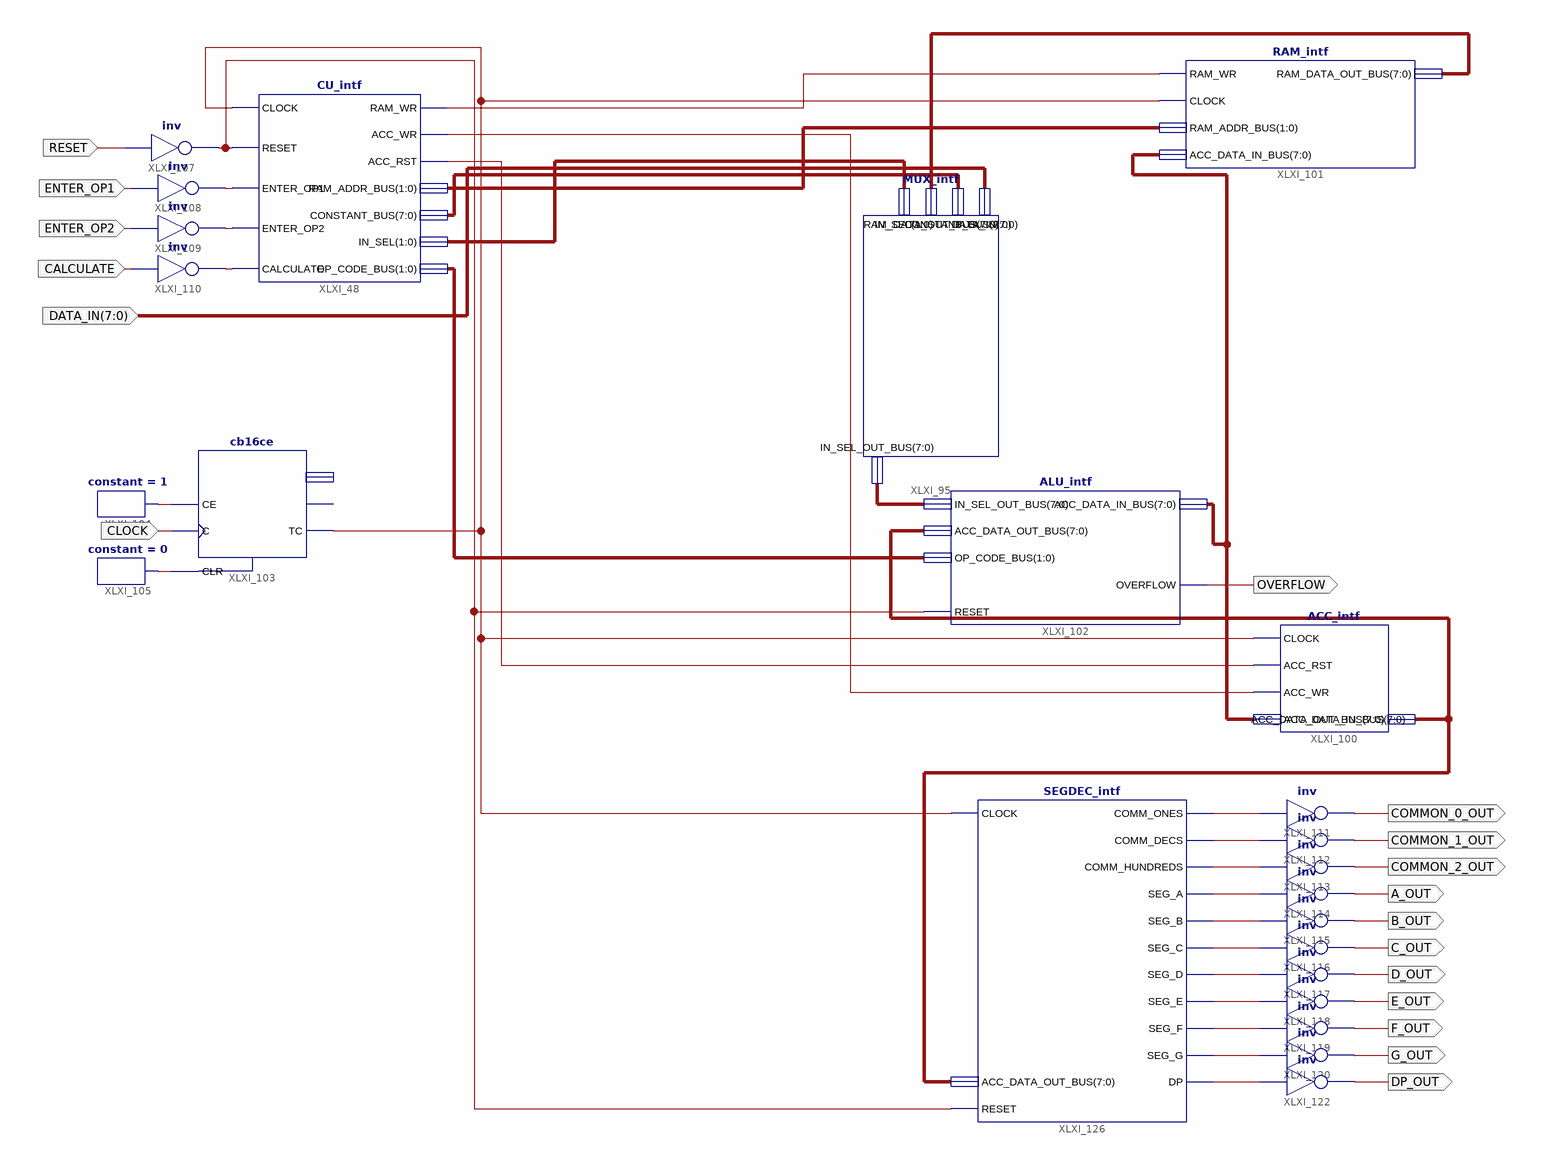
[diagram p0: schematic sheet 1]
// Xilinx ISE schematic TopLevel.sch (spartan3a) as structural Verilog: 24 symbols, 18 ports
module TopLevel (
  input  ENTER_OP1,
  input  ENTER_OP2,
  input  CALCULATE,
  input  CLOCK,
  input  [7:0] DATA_IN,
  input  RESET,
  output COMMON_0_OUT,
  output COMMON_1_OUT,
  output COMMON_2_OUT,
  output B_OUT,
  output C_OUT,
  output E_OUT,
  output F_OUT,
  output OVERFLOW,
  output A_OUT,
  output D_OUT,
  output G_OUT,
  output DP_OUT
);

  wire XLXN_223, XLXN_242, XLXN_243, XLXN_251, XLXN_252, XLXN_259, XLXN_260, XLXN_261, XLXN_262, XLXN_263,
       XLXN_264, XLXN_265, XLXN_266, XLXN_267, XLXN_268, XLXN_269, XLXN_270, XLXN_271, XLXN_272, XLXN_273,
       XLXN_274;
  wire [1:0] XLXN_224, XLXN_234, XLXN_235;
  wire [7:0] XLXN_213, XLXN_240, XLXN_246, XLXN_248, XLXN_249;

  CU_intf XLXI_48 (
    .CLOCK(XLXN_274), .RESET(XLXN_273), .ENTER_OP1(XLXN_259), .ENTER_OP2(XLXN_260), .CALCULATE(XLXN_261),
    .RAM_WR(XLXN_223), .ACC_WR(XLXN_242), .ACC_RST(XLXN_243), .RAM_ADDR_BUS(XLXN_224),
    .CONSTANT_BUS(XLXN_240), .IN_SEL(XLXN_234), .OP_CODE_BUS(XLXN_235));
  MUX_intf XLXI_95 (
    .DATA_IN(DATA_IN), .CONSTANT_BUS(XLXN_240), .RAM_DATA_OUT_BUS(XLXN_249), .IN_SEL(XLXN_234),
    .IN_SEL_OUT_BUS(XLXN_213));
  ACC_intf XLXI_100 (
    .CLOCK(XLXN_274), .ACC_RST(XLXN_243), .ACC_WR(XLXN_242), .ACC_DATA_IN_BUS(XLXN_248),
    .ACC_DATA_OUT_BUS(XLXN_246));
  RAM_intf XLXI_101 (
    .RAM_WR(XLXN_223), .CLOCK(XLXN_274), .RAM_ADDR_BUS(XLXN_224), .ACC_DATA_IN_BUS(XLXN_248),
    .RAM_DATA_OUT_BUS(XLXN_249));
  ALU_intf XLXI_102 (
    .RESET(XLXN_273), .IN_SEL_OUT_BUS(XLXN_213), .ACC_DATA_OUT_BUS(XLXN_246), .OP_CODE_BUS(XLXN_235),
    .OVERFLOW(OVERFLOW), .ACC_DATA_IN_BUS(XLXN_248));
  cb16ce XLXI_103 (.C(CLOCK), .CE(XLXN_251), .CLR(XLXN_252), .TC(XLXN_274));  // open: CEO, Q
  constant #(.CValue("1")) XLXI_104 (.O(XLXN_251));
  constant #(.CValue("0")) XLXI_105 (.O(XLXN_252));
  not XLXI_107 (XLXN_273, RESET);
  not XLXI_108 (XLXN_259, ENTER_OP1);
  not XLXI_109 (XLXN_260, ENTER_OP2);
  not XLXI_110 (XLXN_261, CALCULATE);
  not XLXI_111 (COMMON_0_OUT, XLXN_262);
  not XLXI_112 (COMMON_1_OUT, XLXN_263);
  not XLXI_113 (COMMON_2_OUT, XLXN_264);
  not XLXI_114 (A_OUT, XLXN_265);
  not XLXI_115 (B_OUT, XLXN_266);
  not XLXI_116 (C_OUT, XLXN_267);
  not XLXI_117 (D_OUT, XLXN_268);
  not XLXI_118 (E_OUT, XLXN_269);
  not XLXI_119 (F_OUT, XLXN_270);
  not XLXI_120 (G_OUT, XLXN_271);
  not XLXI_122 (DP_OUT, XLXN_272);
  SEGDEC_intf XLXI_126 (
    .CLOCK(XLXN_274), .RESET(XLXN_273), .ACC_DATA_OUT_BUS(XLXN_246), .COMM_ONES(XLXN_262),
    .COMM_DECS(XLXN_263), .COMM_HUNDREDS(XLXN_264), .SEG_A(XLXN_265), .SEG_B(XLXN_266), .SEG_C(XLXN_267),
    .SEG_D(XLXN_268), .SEG_E(XLXN_269), .SEG_F(XLXN_270), .SEG_G(XLXN_271), .DP(XLXN_272));
endmodule
